# EAGLE schematic Headphone-Amplifier-ClassAB-Stereo-alt (EAGLE 7.6.0)
4x4 - Three Transistor Headphone Amplifier - Class AB http://www.electronics-diy.com/4x4.php
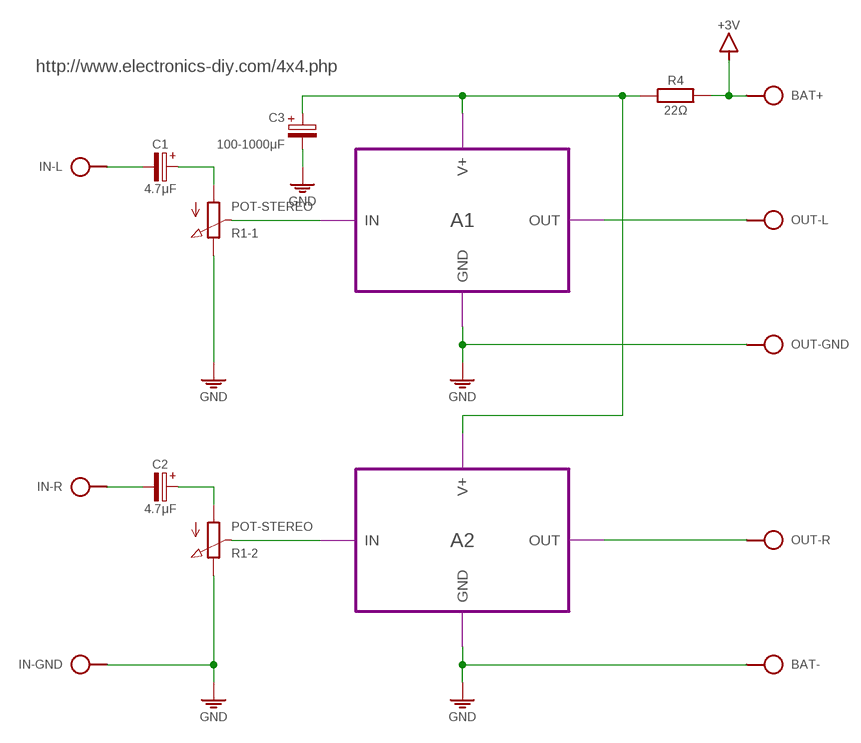
[diagram p0: schematic, sheet 1]

## Parts
BAT  SPAD+-+-  [SPAD+-]
C1  4.7μF  CPOLE2,5-4  [E2,5-4]
C2  4.7μF  CPOLE2,5-4  [E2,5-4]
C3  100-1000μF  CPOLE5-6  [E5-6]
IN  SAUDIO  [SPAD-3]
OUT  SAUDIO  [SPAD-3]
R1  POT-STEREO  [POT-STEREO-2X3]
R4  22Ω  R-H0204/10  [0204/10]

## Module instances
A1 = HDPH-AMP
A2 = HDPH-AMP

## Nets
+3V: BAT.2 R4.2
GND: BAT.1 C3.- IN.2 OUT.2 R1.1-E(-1:E) R1.2-E(-2:E) ; port A1.GND A2.GND
N$1: C3.+ R4.1 ; port A1.V+ A2.V+
N$2: OUT.1 ; port A1.OUT
N$3: C2.- IN.3
N$4: C2.+ R1.2-A(-2:A)
N$5: C1.+ R1.1-A(-1:A)
N$6: R1.1-S(-1:S) ; port A1.IN
N$7: R1.2-S(-2:S) ; port A2.IN
N$8: OUT.3 ; port A2.OUT
N$10: C1.- IN.1

## Notes on the sheet
- http://www.electronics-diy.com/4x4.php

## Library data of the parts
BAT = pad:SPAD+-
C1-C3 = c:CPOL: POLARIZED CAPACITOR, European symbol
IN OUT = pad:SAUDIO
R1 = r:POT-STEREO
R4 = r:R-H

## Module HDPH-AMP
Ports: GND(pwr) V+(pwr) IN(in) OUT(out)
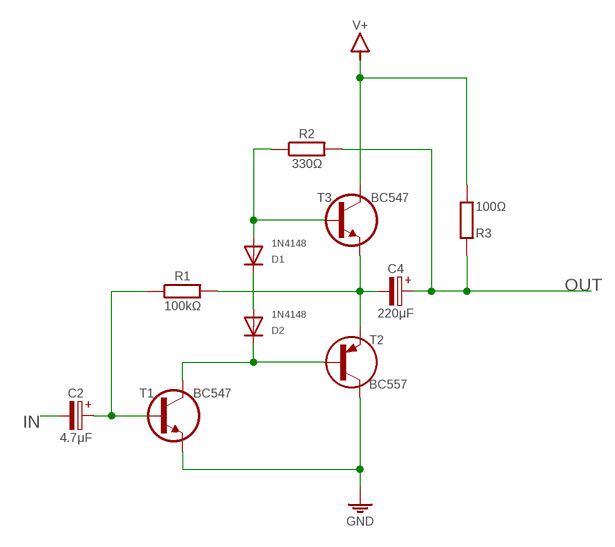
[diagram p1: schematic, module HDPH-AMP, sheet 1]

### Parts
C2  4.7μF  CPOLE2,5-4  [E2,5-4]
C4  220μF  CPOLE5-5/V  [E5-5/V]
D1  1N4148  1N414834-5V  [DO34-5V]
D2  1N4148  1N414834-5V  [DO34-5V]
R1  100kΩ  R-H0202/5-V  [0202/5-V]
R2  330Ω  R-H0202/5-V  [0202/5-V]
R3  100Ω  R0202/5-V  [0202/5-V]
T1  BC547  BC547CBE  [TO92-CBE]
T2  BC557  BC557CBE  [TO92-CBE]
T3  BC547  BC547CBE  [TO92-CBE]

### Nets
GND: T1.E T2.C
IN: C2.-
N$1: D1.A R2.1 T3.B
N$2: D2.C T1.C T2.B
N$3: D1.C D2.A
N$4: C4.- R1.2 T2.E T3.E
N$7: C2.+ R1.1 T1.B
OUT: C4.+ R2.2 R3.2
V+: R3.1 T3.C

### Library data of the parts
C2 C4 = c:CPOL: POLARIZED CAPACITOR, European symbol
D1 D2 = d:1N4148
R1 R2 = r:R-H
R3 = r:R: RESISTOR, European symbol
T1 T3 = t:BC547
T2 = t:BC557